# EAGLE schematic v0.0 (EAGLE 5.11)
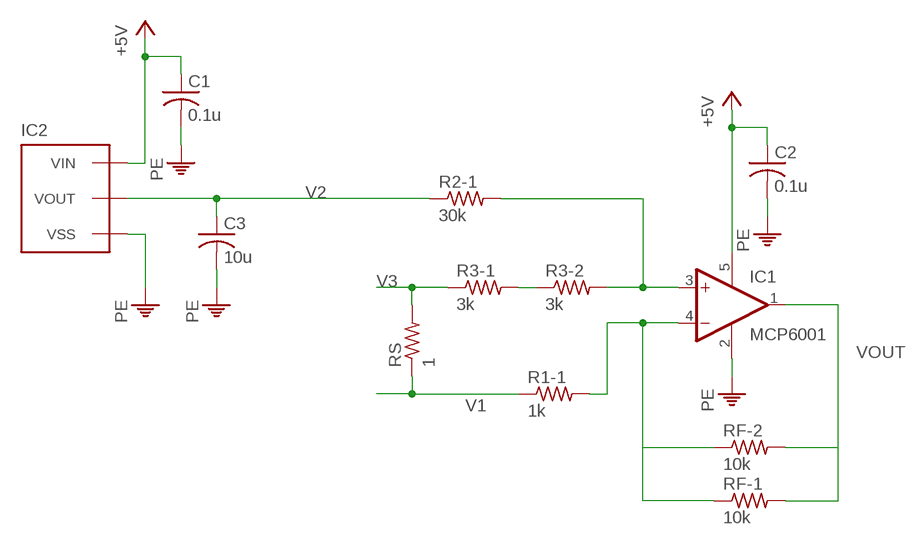
[diagram p0: schematic, sheet 1]

## Parts
C1  0.1u  C-USC0805  [C0805]
C2  0.1u  C-USC0805  [C0805]
C3  10u  C-USC0805  [C0805]
IC1  MCP6001  [SOT-23-5L]
IC2  MCP1525  [SOT23]
R1-1  1k  R-US_R0805  [R0805]
R2-1  30k  R-US_R0805  [R0805]
R3-1  3k  R-US_R0805  [R0805]
R3-2  3k  R-US_R0805  [R0805]
RF-1  10k  R-US_R0805  [R0805]
RF-2  10k  R-US_R0805  [R0805]
RS  1  R-US_R2512  [R2512]

## Nets
+5V: C1.1 C2.1 IC1.5(V+) IC2.1(VIN)
N$1: IC1.3(+IN) R2-1.2 R3-2.2
N$6: R3-1.2 R3-2.1
N$9: IC1.4(-IN) R1-1.2 RF-1.1 RF-2.1
PE: C1.2 C2.2 C3.2 IC1.2(V-) IC2.3(VSS)
V1: R1-1.1 RS.1
V2: C3.1 IC2.2(VOUT) R2-1.1
V3: R3-1.1 RS.2
VOUT: IC1.1(OUT) RF-1.2 RF-2.2

## Library data of the parts
C1-C3 = rcl:C-US: CAPACITOR, American symbol
IC1 = Alan Rosenthal:MCP6001
IC2 = Alan Rosenthal:MCP1525
R1-1 R2-1 R3-1 R3-2 RF-1 RF-2 RS = rcl:R-US_: RESISTOR, American symbol